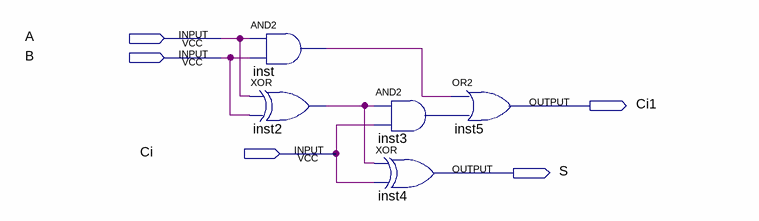
[diagram p0: schematic sheet]
// Quartus schematic fulladd.bdf as structural Verilog: 5 symbols, 5 pins
module fulladd (
  input  A,
  input  B,
  input  Ci,
  output Ci1,
  output S
);

  wire inst2_out, inst3_out, inst_out;

  and inst (inst_out, A, B);
  xor inst2 (inst2_out, A, B);
  and inst3 (inst3_out, inst2_out, Ci);
  xor inst4 (S, inst2_out, Ci);
  or inst5 (Ci1, inst_out, inst3_out);
endmodule
